# EAGLE design nRF52-AvmBeacon23cmMonopole (EAGLE 9.6.2)
Assembly variants: BomList
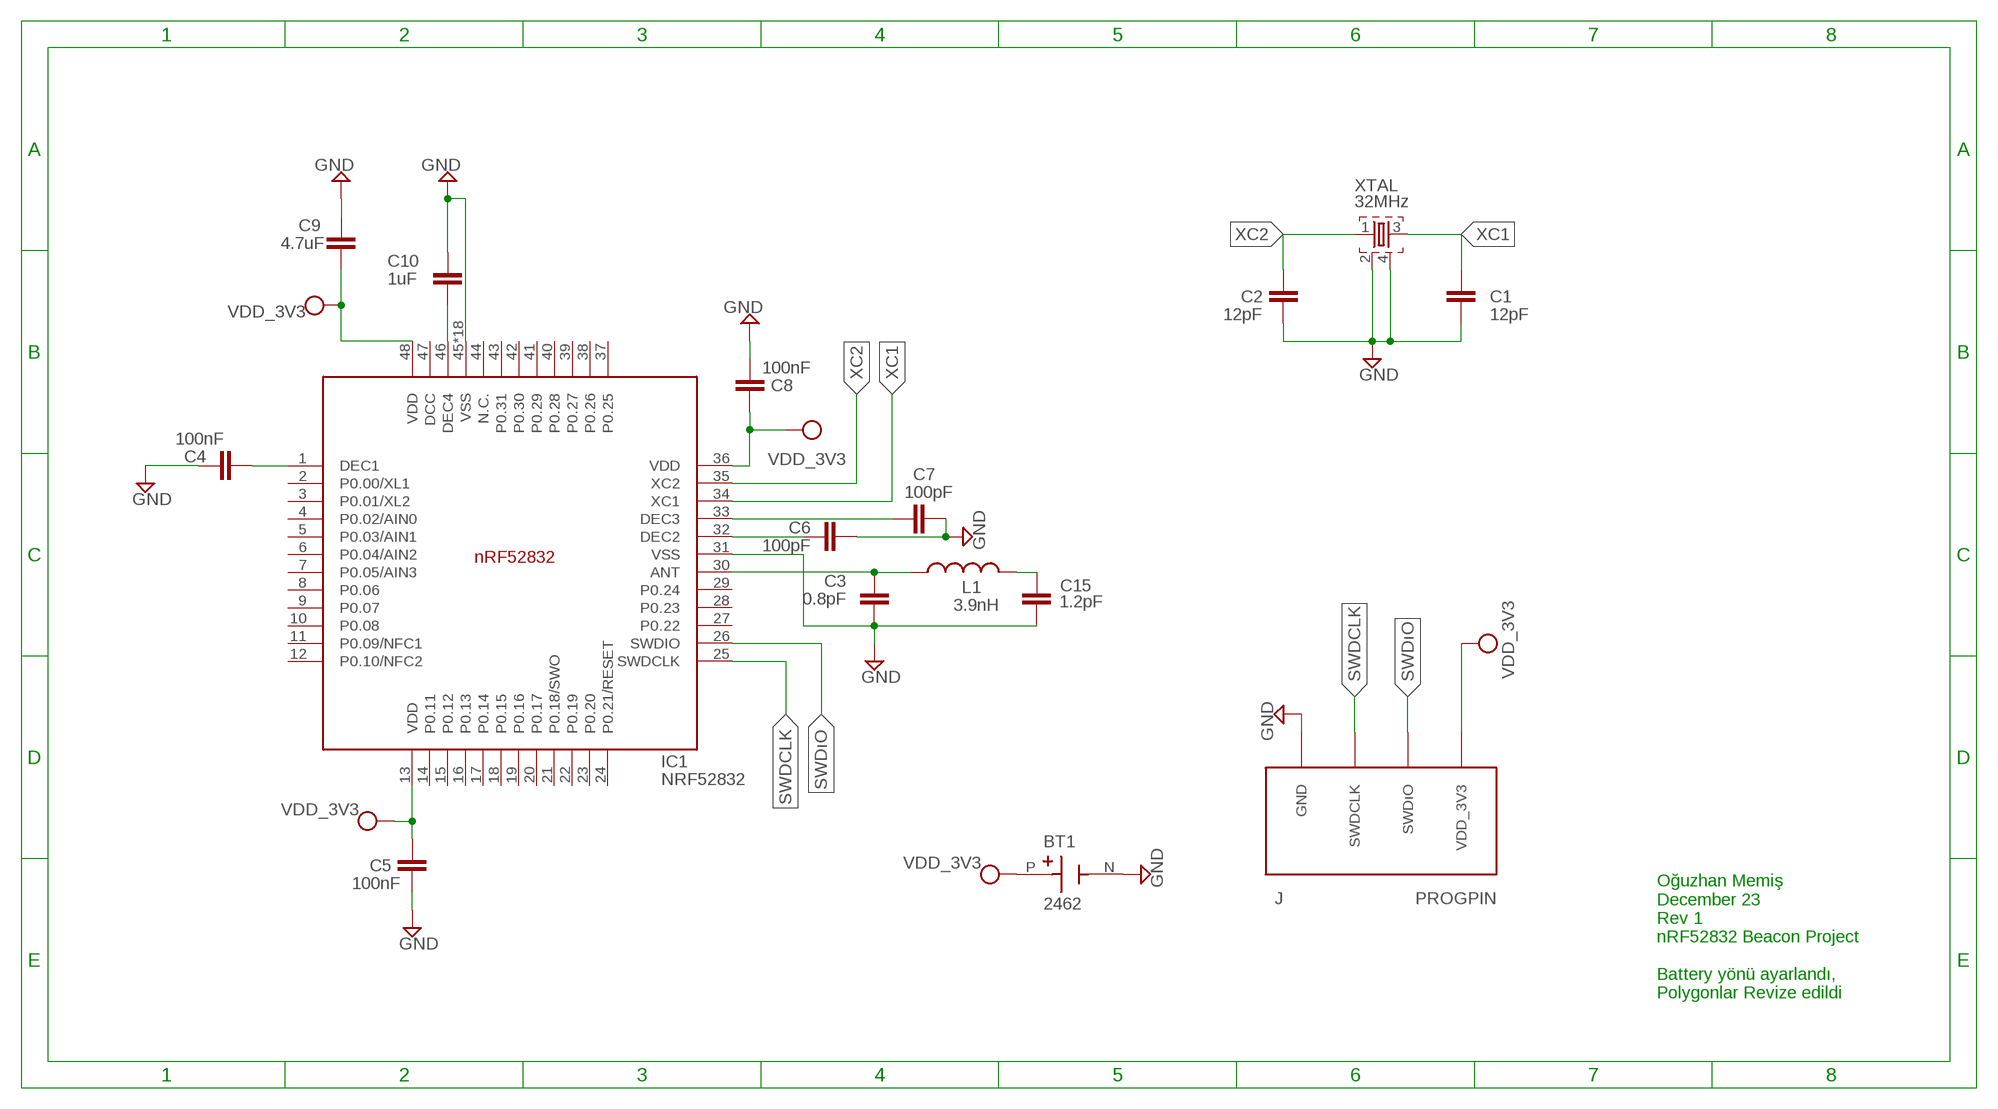
[diagram p0: schematic, sheet 1]

## Parts
BT1  2462  [BAT_2462]
C1  12pF  CAPACITOR_0402_N  [RESC0402_N]
C2  12pF  CAPACITOR_0402_N  [RESC0402_N]
C3  0.8pF  CAPACITOR_0402_N  [RESC0402_N]
C4  100nF  CAPACITOR_0402_N  [RESC0402_N]
C5  100nF  CAPACITOR_0402_N  [RESC0402_N]
C6  100pF  CAPACITOR_0402_N  [RESC0402_N]
C7  100pF  CAPACITOR_0402_N  [RESC0402_N]
C8  100nF  CAPACITOR_0402_N  [RESC0402_N]
C9  4.7uF  CAPACITOR_0603_N  [RESC0603_N]
C10  1uF  CAPACITOR_0603_N  [RESC0603_N]
C15  1.2pF  CAPACITOR_0402_N  [RESC0402_N]
IC1  NRF52832  [QFN40P600X600X90-48_N]
L1  3.9nH  INDUCTOR_0402_N  [RESC0402_N]
U$1  PROGPIN4*2.54  [PROGPIN]  (not fitted in variant BomList)
XTAL  32MHz  XTAL_32MHZ  [BT-XTAL_2016_N]

## Nets
GND: BT1.N(NEG) C1.2 C2.2 C3.1 C4.1 C5.2 C6.2 C7.2 C8.2 C9.1 C10.1 C15.2 IC1.31(VSS) IC1.45(VSS) IC1.PAD(VSS) IC1.PAD@VIA01(VSS) IC1.PAD@VIA02(VSS) IC1.PAD@VIA03(VSS) IC1.PAD@VIA04(VSS) IC1.PAD@VIA05(VSS) IC1.PAD@VIA06(VSS) IC1.PAD@VIA07(VSS) IC1.PAD@VIA08(VSS) IC1.PAD@VIA09(VSS) IC1.PAD@VIA10(VSS) IC1.PAD@VIA11(VSS) IC1.PAD@VIA12(VSS) IC1.PAD@VIA13(VSS) IC1.PAD@VIA14(VSS) IC1.PAD@VIA15(VSS) IC1.PAD@VIA16(VSS) U$1.GND XTAL.2 XTAL.4
N$1: C4.2 IC1.1(DEC1)
N$2: C3.2 IC1.30(ANT) L1.1
N$4: C6.1 IC1.32(DEC2)
N$5: C7.1 IC1.33(DEC3)
N$6: C10.2 IC1.46(DEC4)
SWDCLK: IC1.25(SWDCLK) U$1.SWDCLK
SWDıO: IC1.26(SWDIO) U$1.SWDIO(SWDıO)
TL: C15.1 L1.2
VDD: BT1.P(POS) C5.1 C8.1 C9.2 IC1.13(VDD) IC1.36(VDD) IC1.48(VDD) U$1.VDD_3V3
XC1: C1.1 IC1.34(XC1) XTAL.3
XC2: C2.1 IC1.35(XC2) XTAL.1
Unconnected: IC1.2(P0.00/XL1) IC1.3(P0.01/XL2) IC1.4(P0.02/AIN0) IC1.5(P0.03/AIN1) IC1.6(P0.04/AIN2) IC1.7(P0.05/AIN3) IC1.8(P0.06) IC1.9(P0.07) IC1.10(P0.08) IC1.11(P0.09/NFC1) IC1.12(P0.10/NFC2) IC1.14(P0.11) IC1.15(P0.12) IC1.16(P0.13) IC1.17(P0.14) IC1.18(P0.15) IC1.19(P0.16) IC1.20(P0.17) IC1.21(P0.18/SWO) IC1.22(P0.19) IC1.23(P0.20) IC1.24(P0.21/RESET) IC1.27(P0.22) IC1.28(P0.23) IC1.29(P0.24) IC1.37(P0.25) IC1.38(P0.26) IC1.39(P0.27) IC1.40(P0.28) IC1.41(P0.29) IC1.42(P0.30) IC1.43(P0.31) IC1.44(N.C.) IC1.47(DCC)

## Notes on the sheet
- Oğuzhan Memiş
  December 23
  Rev 1 
  nRF52832 Beacon Project
  
  Battery yönü ayarlandı,
  Polygonlar Revize edildi

## Library data of the parts
BT1 = 2462:2462: Check availability <https://pricing.snapeda.com/parts/2462/Keystone/view-part?ref=eda>; AVAILABILITY: In Stock; CHECK_PRICES: https://www.snapeda.com/parts/2462/Keystone+Electronics/view-part/?ref=eda; DESCRIPTION: Battery Holder, AA, Polypropylene, PC Mount, 2, Spring, PC Lug | Keystone Electronics 2462; MF: Keystone; MP: 2462; PACKAGE: None; PRICE: None; SNAPEDA_LINK: https://www.snapeda.com/parts/2462/Keystone+Electronics/view-part/?ref=snap
C1-C10 = Nordic_misc:CAPACITOR: Generic chip capacitor
C15 = Nordic_nRF:CAPACITOR: Generic chip capacitor
IC1 = Nordic_nRF:NRF52832: nRF52832 Features Single chip, highly flexible, 2.4 GHz multi-protocol SoC 32-bit ARM Cortex-M4F Processor 1.7v to 3.6v operation 512kB flash + 64kB RAM Supports concurrent Bluetooth Smart/ANT protocol operation On-chip NFC tag for Out-of-Band (OOB) pairing Up to +4dBm output power -96dBm sensitivity, Bluetooth Smart Thread safe and run-time protected Event driven API On air compatible with nRF24L and nRF24AP series 2 data rates (2Mbps/1Mbps) PPI - maximum flexibility for power-efficient applications and code simplification Automated power management system with automatic power management of each peripheral Configurable I/O mapping for analog and digital I/O 3 x Master/Slave SPI 2 x Two-wire interface (I²C) UART (RTS/CTS) 3 x PWM AES HW encryption Real Time Counter (RTC) Digital microphone interface (PDM) On-chip balun Applications Internet of Things (IoT) Wearables SmartHome sensors Connected white goods Computer peripherals Voice-command smart remotes A4WP ‘Rezence’ wireless charging Beacons Sports and fitness sensors and hubs Connected health products Smart watches RC Toys Interactive games Building automation and sensor networks
L1 = Nordic_misc:INDUCTOR: Generic chip inductor
U$1 = 2023Poi:PROGPIN
XTAL = Nordic_nRF:XTAL_32MHZ

## Board
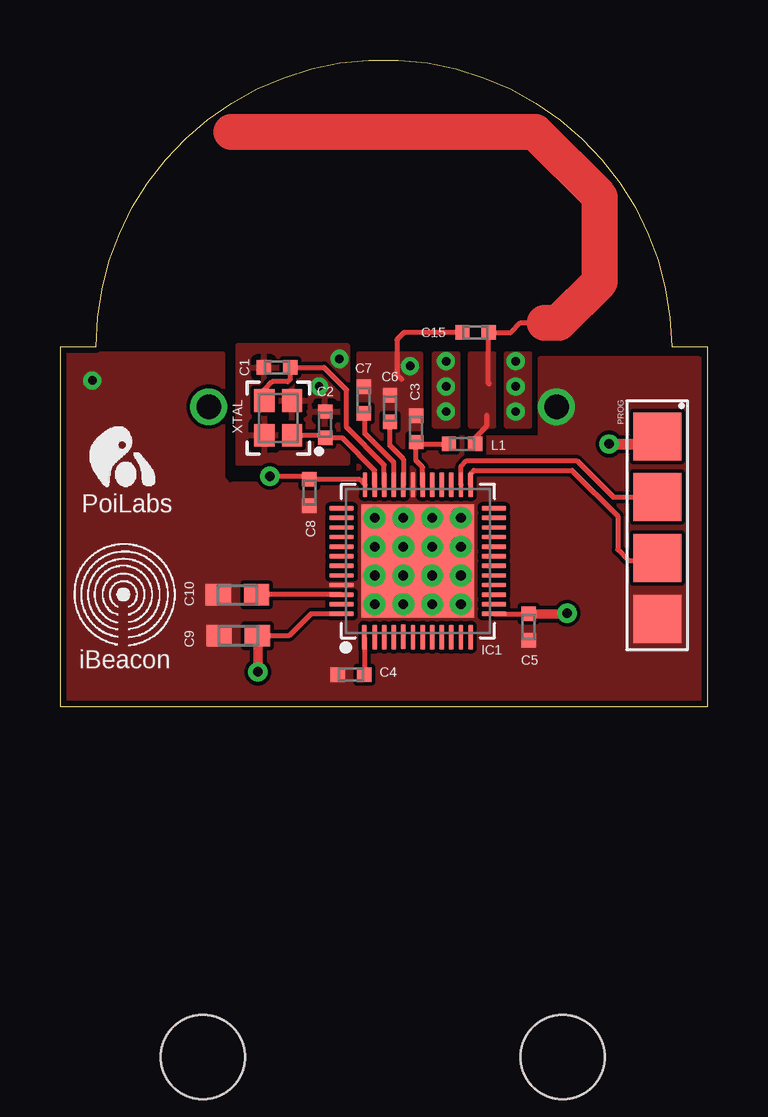
[diagram p1: board, top side]
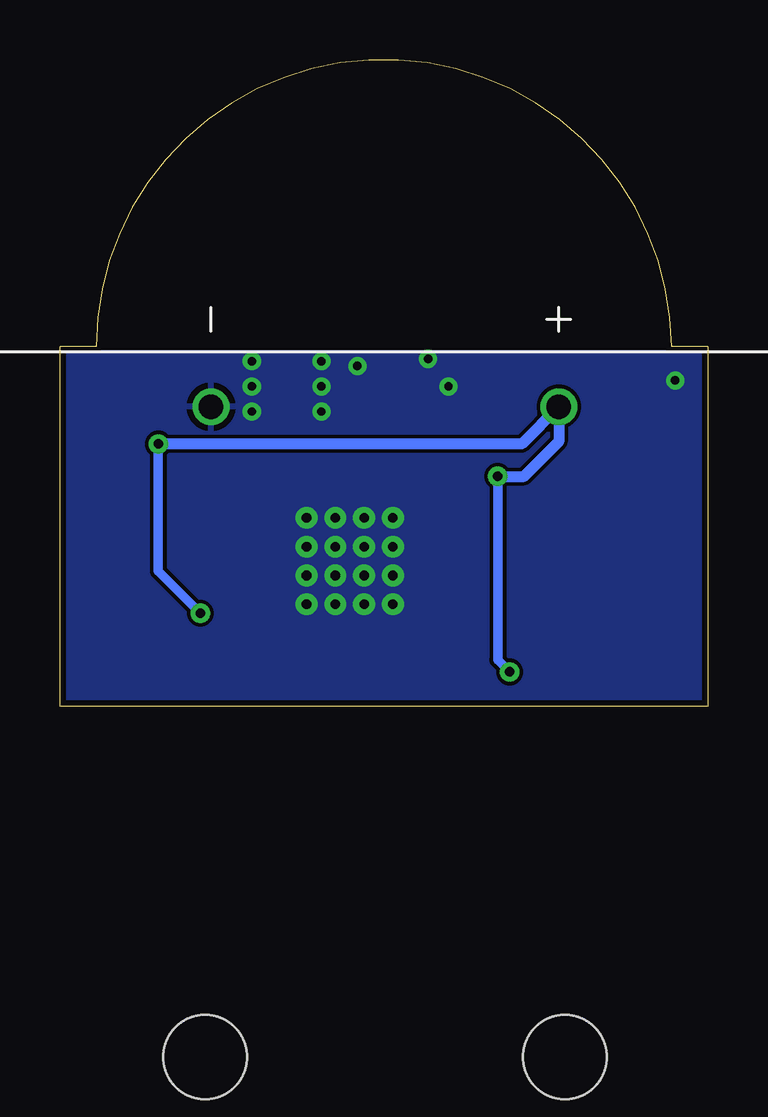
[diagram p2: board, bottom side, seen from below]

Size 27 x 26.96 mm. Coordinates in mm from the lower left corner, seen from the top.
Outline: 0,0 27,0 27,15 25.5,15 arc180 1.5,15 0,15 0,0
Copper layers (1*16): Top 0.035mm / dielectric 1.5mm / Bottom 0.035mm
Design rules "default *": minimum track width 6mil, minimum drill 0.35mm, track to track 6mil, track to pad 6mil, pad to pad 6mil, via to via 6mil, smd to smd 6mil, copper to edge 10mil, drill to drill 6mil, minimum pad ring 10mil, minimum via ring 8mil, stop-mask expansion 4mil, vias tented up to drill 0mil, thermal gap 10mil

### Footprints (pad centres in the part's own frame; a part is rotated, then mirrored left to right if it is on the bottom)
BAT_2462 = drill 1.02: N 27.1,7.25; P 27.1,-7.25 | hole 3.5: 0,7.5; 0,-7.5
RESC0402_N = smd 0.6 x 0.6: 1 -0.55,0; 2 0.55,0
RESC0603_N = smd 1.05 x 0.9: 1 -0.8,0; 2 0.8,0
QFN40P600X600X90-48_N = smd 1.031 x 0.2: 1 -3.178,2.225; 2 -3.178,1.8; 3 -3.178,1.4; 4 -3.178,1; 5 -3.152,0.6; 6 -3.178,0.2; 7 -3.178,-0.2; 8 -3.178,-0.6; 9 -3.178,-1; 10 -3.178,-1.4; 11 -3.178,-1.8; 12 -3.178,-2.2; 25 3.178,-2.2; 26 3.178,-1.8; 27 3.178,-1.4; 28 3.178,-1; 29 3.178,-0.6; 30 3.178,-0.2; 31 3.178,0.2; 32 3.178,0.6; 33 3.178,1; 34 3.178,1.4; 35 3.178,1.8; 36 3.178,2.2 | smd 0.2 x 1.031: 13 -2.2,-3.178; 14 -1.8,-3.178; 15 -1.4,-3.178; 16 -1,-3.178; 17 -0.6,-3.178; 18 -0.2,-3.178; 19 0.2,-3.178; 20 0.6,-3.178; 21 1,-3.178; 22 1.4,-3.178; 23 1.8,-3.178; 24 2.2,-3.178; 37 2.2,3.178; 38 1.8,3.178; 39 1.4,3.178; 40 1,3.178; 41 0.6,3.178; 42 0.2,3.178; 43 -0.2,3.178; 44 -0.6,3.178; 45 -1,3.178; 46 -1.4,3.178; 47 -1.8,3.178; 48 -2.2,3.178 | smd 4.7 x 4.7: PAD 0,0 | drill 0.4: PAD@VIA01 -1.8,1.8; PAD@VIA02 -1.8,0.6; PAD@VIA03 -1.8,-0.6; PAD@VIA04 -1.8,-1.8; PAD@VIA05 -0.6,1.8; PAD@VIA06 -0.6,0.6; PAD@VIA07 -0.6,-0.6; PAD@VIA08 -0.6,-1.8; PAD@VIA09 0.6,1.8; PAD@VIA10 0.6,0.6; PAD@VIA11 0.6,-0.6; PAD@VIA12 0.6,-1.8; PAD@VIA13 1.8,1.8; PAD@VIA14 1.8,0.6; PAD@VIA15 1.8,-0.6; PAD@VIA16 1.8,-1.8
PROGPIN = smd 2 x 2: GND 7.62,0; SWDCLK 5.08,0; SWDIO 2.54,0; VDD_3V3 0,0
BT-XTAL_2016_N = smd 0.95 x 0.85: 1 -0.725,-0.575; 2 0.725,-0.575; 3 0.725,0.575; 4 -0.725,0.575

### Placement (x,y rotation side)
BT1  13.45,-14.6 90 bottom
C1  9.05,14.14 180 top
C2  11.06,11.75 90 top
C3  14.85,11.58 270 top
C4  12.13,1.34 0 top
C5  19.54,3.32 270 top
C6  13.76,12.43 90 top
C7  12.66,12.78 90 top
C8  10.4,8.93 270 top
C9  7.43,2.96 0 top
C10  7.4,4.66 0 top
C15  17.33,15.6 180 top
IC1  14.92,6.07 90 top
L1  16.77,10.95 0 top
U$1  24.9,11.27 270 top
U$2  [IBEACON]  2.35,4.65 0 top
U$3  [POILOGO]  1.95,9.15 0 top
XTAL  9.1,12.04 90 top

### Tracks (layer width: path | path; a pad name or v marks a point on that pad's centre or on a via)
GND  (via drill 0.35)
  Top 0.2: C15.2 14.35,15.6 14.05,15.3 14.05,13.85 14.25,13.65
  other vias: 16.1,14.4 19,12.3 19,13.35 19,14.4 16.1,13.35 16.1,12.3 1.35,13.6 11.65,14.5 14.6,14.2 10.8,13.35
  pour Top: 15.6,14.7 15.6,11.7 16.6,11.7 16.6,14.7
  pour Top: 18.6,14.7 18.6,11.7 19.6,11.7 19.6,14.7
  pour Top: 7.4,15.05 7.4,10.15 12,10.15 12,15.05
  pour Top (no thermals): 0.15,0.15 26.9,0.15 26.9,14.25 26.65,14.5 20,14.5 20,11.2 15.05,11.2 15.05,14.7 12.45,14.7 12.45,9.6 12.1,9.25 7.15,9.25 7.1,9.2 6.8,9.5 6.8,14.7 0.15,14.7
  pour Bottom: 0.13,14.78 0.13,0.22 0.45,-0.1 26.55,-0.1 27.1,0.45 27.1,14.78
N$1
  Top 0.2: IC1.1 12.7,1.35 C4.2
N$2
  Top 0.2: IC1.30 15.12,9.98 14.85,10.25 C3.2 14.93,10.95 L1.1
N$4
  Top 0.2: C6.1 13.76,10.88 14.32,10.32 IC1.32
N$5
  Top 0.2: IC1.33 13.92,10.18 12.7,11.4 12.7,12.19 C7.1
N$6
  Top 0.2: IC1.46 C10.2
SWDCLK
  Top 0.2: IC1.25 17.12,9.72 17.25,9.85 21.35,9.85 23.25,7.95 23.25,6.55 23.7,6.1 24.81,6.1 U$1.SWDCLK
SWDıO
  Top 0.2: IC1.26 16.72,10.02 16.95,10.25 21.55,10.25 23.07,8.73 U$1.SWDIO
TL
  Top 0.2: 17.9,13.45 17.85,13.5 17.85,15.57 C15.1 18.8,15.6 19.2,16 20.2,16 | L1.2 17.32,11.22 17.8,11.7 17.8,12.15
  Top 1.5: 20.2,16 20.8,16 22.5,17.7 22.5,21.26 19.81,23.95 7.15,23.95
  pour Top: 17.1,14.7 17.1,11.7 18.1,11.7 18.1,14.7
VDD  (via drill 0.4)
  Top 0.2: IC1.13 C5.1 | IC1.48 10.47,3.87 9.55,2.95 C9.2 | v8.75,9.6 10.28,9.6 C8.1 12.49,9.48 IC1.36
  Top 0.4: C9.2 8.25,2.94 v8.25,1.45 | C5.1 21.12,3.87 v21.15,3.9
  Top 0.45: v22.9,10.95 24.58,10.95 U$1.VDD_3V3
  Bottom 0.4: v8.75,9.6 8.75,1.95 v8.25,1.45 | v22.9,10.95 22.9,5.65 v21.15,3.9
  Bottom 0.45: v22.9,10.95 7.75,10.95 BT1.P 6.2,11.05 7.65,9.6 v8.75,9.6
XC1
  Top 0.2: XTAL.3 8.53,13.22 8.85,13.55 9.5,13.55 9.6,13.65 C1.1 11.01,14.14 11.95,13.2 11.95,11.65 13.52,10.08 IC1.34
XC2
  Top 0.2: XTAL.1 10.95,11.31 C2.1 11.77,11.2 13.12,9.85 IC1.35

### Text on the board
tNames: PoiLabs | iBeacon